# Altium project encoder_project.PrjPcb
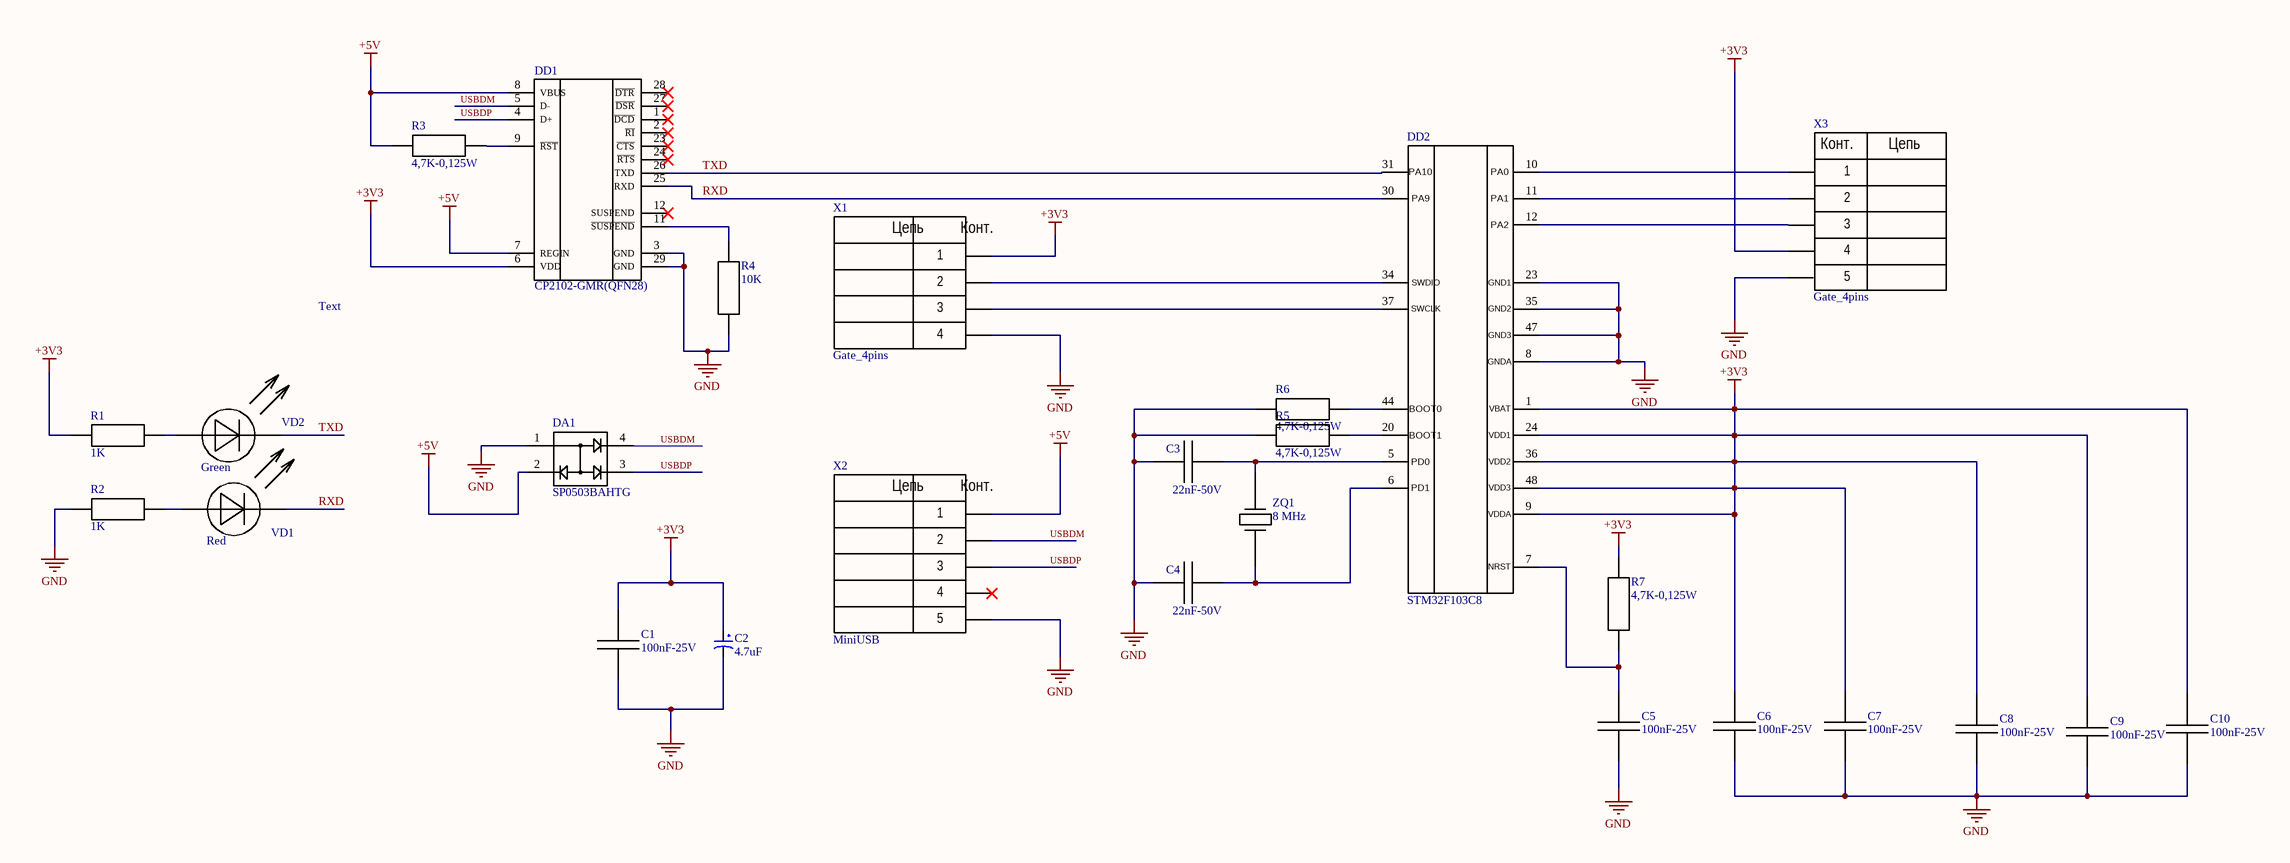
[diagram p0: encoder.SchDoc]
1 sheet, 26 parts. Net scope: global (net labels, ports and power ports of the same name join across sheets).
Board file: encoder.PcbDoc

## Sheet encoder.SchDoc
size A2

### Parts
C1  100nF-25V  [Cap Ceramic 0603 SMD]
C2  4.7uF  [cap tantalum  smd a]
C3  22nF-50V  [Cap Ceramic 0805 SMD]
C4  22nF-50V  [Cap Ceramic 0805 SMD]
C5  100nF-25V  [Cap Ceramic 0603 SMD]
C6  100nF-25V  [Cap Ceramic 0603 SMD]
C7  100nF-25V  [Cap Ceramic 0603 SMD]
C8  100nF-25V  [Cap Ceramic 0603 SMD]
C9  100nF-25V  [Cap Ceramic 0603 SMD]
C10  100nF-25V  [Cap Ceramic 0603 SMD]
DA1  SP0503BAHTG  [SOT143]
DD1  CP2102-GMR(QFN28)  [QFN28G_0.5-5X5MM]
DD2  STM32F103C8  [stm32f103c8t6-48LQFP]
R1  1K  [Res 0805 SMD]
R2  1K  [Res 0805 SMD]
R3  4,7K-0,125W  [Res 0805 SMD]
R4  10K  [Res 0805 SMD]
R5  4,7K-0,125W  [Res 0805 SMD]
R6  4,7K-0,125W  [Res 0805 SMD]
R7  4,7K-0,125W  [Res 0805 SMD]
VD1  Red  [Led 0805R]
VD2  Green  [Led 0805G]
X1  Gate_4pins  [Header_4]
X2  MiniUSB  [USB_MNI_B]
X3  Gate_4pins  [Header_5]
ZQ1  8 MHz  [CRYSTAL-HC49S]

### Nets
+3V3: C1.2 C2.1 C6.2 C7.2 C8.2 C9.2 C10.2 DD1.6(VDD) DD2.1 DD2.9 DD2.24 DD2.36 DD2.48 R1.2 R7.2 X1.1 X3.4
+5V: DA1.2 DD1.7(REGIN) DD1.8(VBUS) R3.1 X2.1
GND: C1.1 C2.2 C3.1 C4.1 C5.1 C6.1 C7.1 C8.1 C9.1 C10.1 DA1.1 DD1.3(GND) DD1.29(GND) DD2.8 DD2.23 DD2.35 DD2.47 R2.2 R4.1 R5.1 R6.1 X1.4 X2.5 X3.5
RXD: DD1.25(RXD) DD2.30 VD1.2
TXD: DD1.26(TXD) DD2.31 VD2.2
USBDM: DA1.4 DD1.5(D-) X2.2
USBDP: DA1.3 DD1.4(D+) X2.3
NetC3_2: C3.2 DD2.5 ZQ1.2
NetC4_2: C4.2 DD2.6 ZQ1.1
NetC5_2: C5.2 DD2.7 R7.1
NetDD1_9: DD1.9(~{RST}) R3.2
NetDD1_11: DD1.11(~{SUSPEND}) R4.2
NetDD2_10: DD2.10 X3.1
NetDD2_11: DD2.11 X3.2
NetDD2_12: DD2.12 X3.3
NetDD2_20: DD2.20 R5.2
NetDD2_34: DD2.34 X1.2
NetDD2_37: DD2.37 X1.3
NetDD2_44: DD2.44 R6.2
NetR1_1: R1.1 VD2.1
NetR2_1: R2.1 VD1.1

Not connected (* = marked no-connect by the designer): DD1 1(~{DCD})* 2(~{RI})* 12(SUSPEND)* 23(~{CTS})* 24(~{RTS})* 27(~{DSR})* 28(~{DTR})*; X2 4*

### Notes on the sheet
- Text
- (in symbol Gate_4pins) Цепь; Конт.
- (in symbol Gate_5pins) Конт.; Цепь
- (in symbol Mini_USB) Цепь; Конт.
- (in symbol STM32F103C8T6) PA10; PA0; PA9; PA1; PA2; SWDIO; GND1; SWCLK; GND2; GND3; GNDA; BOOT0; VBAT; BOOT1; VDD1; PD0; VDD2; PD1; VDD3; VDDA; NRST

### Library data of the parts
C1 C5-C10 = Cap_100nF
C2 = Cap_tantalum_4.7uF 16V: SMD; Chung_Loai: Dán; Don_Vi: Con; So_Chan: 2; Ten_Linh_Kien: Tụ tantalum 475C-4.7uF 16V SMD3216; Ma_Hang: MH008686; Kieu_Chan: *
C3 C4 = Cap_22nF
DA1 = SP0503BAHTG: MF: Littelfuse Inc.; MP: SP0503BAHTG; Package: SOT-143 Littelfuse; SnapEDA_Link: https://www.snapeda.com/parts/SP0503BAHTG/Littelfuse%20Inc./view-part/214427/?ref=snap; Digi-Key_Purchase_URL: https://www.digikey.com/product-detail/en/littelfuse-inc/SP0503BAHTG/F2715CT-ND/1154322?utm_source=snapeda&utm_medium=aggregator&utm_campaign=symbol; Value: *; Digi-Key_Part_Number: F2715CT-ND
DD1 = CP2102-GMR(QFN28): USB Bridge, USB to UART USB 2.0 UART; MF: Silicon; SnapEDA_Link: https://www.snapeda.com/parts/CP2102-GMR/Silicon%20Labs/view-part/570818/?ref=snap; MP: CP2102-GMR; Price: None; Availability: Unavailable; Value: *; Package: VFQFN-28 Vishay Siliconix
DD2 = STM32F103C8T6
R1 R2 = Res_1K
R3 R5-R7 = Res_4K7
R4 = Res_10K
VD1 = LED_red
VD2 = LED_green
X2 = Mini_USB
X3 = Gate_5pins
ZQ1 = Quartz resonator_8MHz